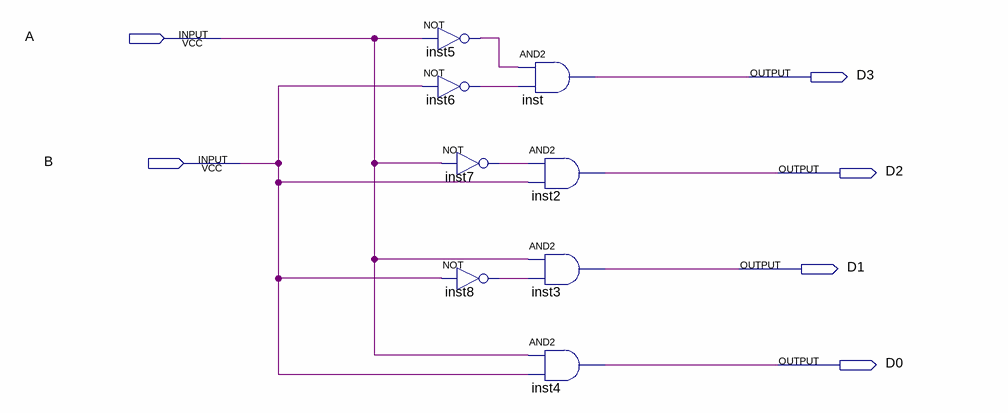
[diagram p0: schematic sheet]
// Quartus schematic codificador.bdf as structural Verilog: 8 symbols, 6 pins
module codificador (
  input  A,
  input  B,
  output D3,
  output D2,
  output D1,
  output D0
);

  wire inst5_out, inst6_out, inst7_out, inst8_out;

  not inst5 (inst5_out, A);
  not inst6 (inst6_out, B);
  not inst7 (inst7_out, A);
  not inst8 (inst8_out, B);
  and inst (D3, inst5_out, inst6_out);
  and inst2 (D2, inst7_out, B);
  and inst3 (D1, A, inst8_out);
  and inst4 (D0, A, B);
endmodule
